# EAGLE schematic v1 (EAGLE 6.4)
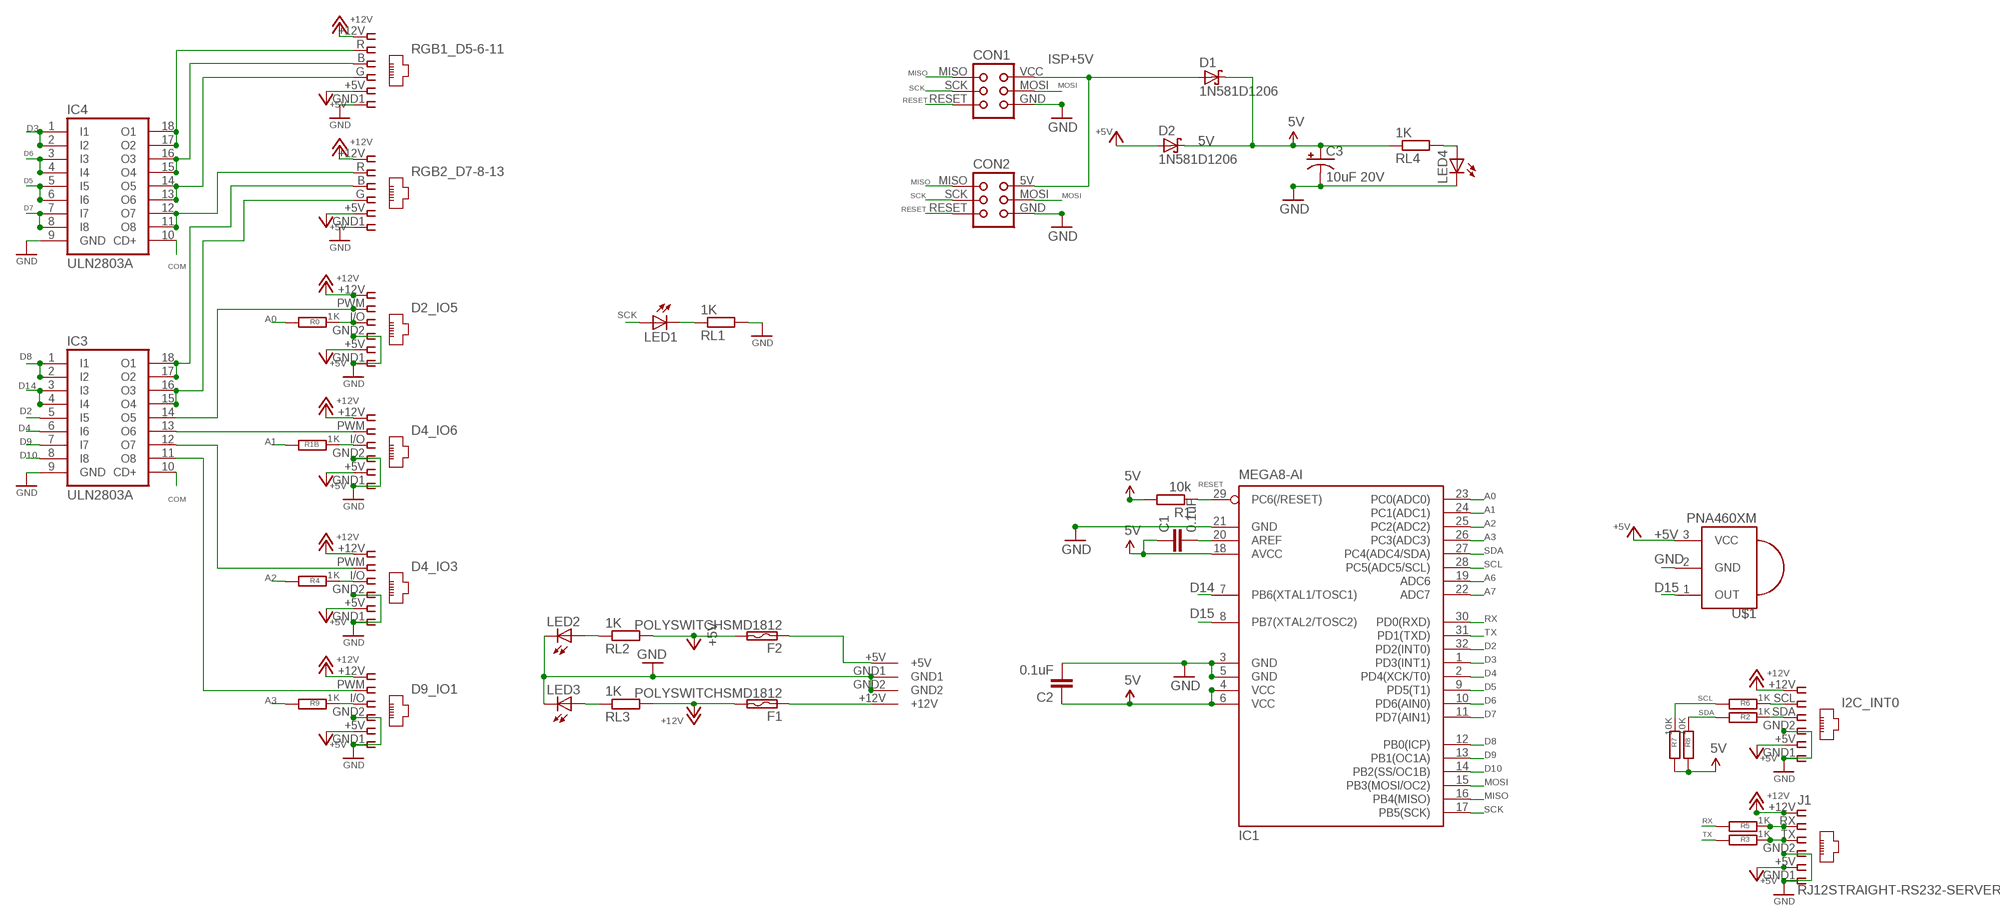
[diagram p0: schematic, sheet 1]

## Parts
C1  0.1uF  C-EUC1206  [C1206]
C2  0.1uF  C-EUC1206  [C1206]
C3  10uF 20V  CAP_POL1206-KIT  [EIA3216-KIT]
CON1  TINYISP  [TINYISP]
CON2  TINYISPTAG  [TC2030-MCP]
D1  1N581D1206  [LED-1206]
D2  1N581D1206  [LED-1206]
D2_IO5  IO5  RJ12STRAIGHT  [RJ12-STRAIGHT]
D4_IO3  IO3  RJ12STRAIGHT  [RJ12-STRAIGHT]
D4_IO6  IO6  RJ12STRAIGHT  [RJ12-STRAIGHT]
D9_IO1  IO1  RJ12STRAIGHT  [RJ12-STRAIGHT]
F1  POLYSWITCHSMD1812  [C1812]
F2  POLYSWITCHSMD1812  [C1812]
I2C_INT0  I2C  RJ12STRAIGHT-I2C  [RJ12-STRAIGHT-I2C]
IC1  MEGA8-AI  [TQFP32-08]
IC3  ULN2803A  [SO18W]
IC4  ULN2803A  [SO18W]
J1  RJ12STRAIGHT-RS232-SERVER  [RJ12-STRAIGHT-RS232]
LED1  LED3MM  [LED3MM]
LED2  LED3MM  [LED3MM]
LED3  LED3MM  [LED3MM]
LED4  LED3MM  [LED3MM]
R0  1K  R-EU_M1206  [M1206]
R1  10k  R-EU_M1206  [M1206]
R1B  1K  R-EU_M1206  [M1206]
R2  1K  R-EU_M1206  [M1206]
R3  1K  R-EU_M1206  [M1206]
R4  1K  R-EU_M1206  [M1206]
R5  1K  R-EU_M1206  [M1206]
R6  1K  R-EU_M1206  [M1206]
R7  10K  R-EU_M1206  [M1206]
R8  10K  R-EU_M1206  [M1206]
R9  1K  R-EU_M1206  [M1206]
RGB1_D5-6-11  RGB1  RJ12STRAIGHT-RGB  [RJ12-STRAIGHT-RGB]
RGB2_D7-8-13  RGB2  RJ12STRAIGHT-RGB  [RJ12-STRAIGHT-RGB]
RL1  1K  R-EU_M1206  [M1206]
RL2  1K  R-EU_M1206  [M1206]
RL3  1K  R-EU_M1206  [M1206]
RL4  1K  R-EU_M1206  [M1206]
U$1  PNA460XM  [PNA460XM]
U$2  KPJX-4S-S  [KPJX-4S-S]

## Nets
5V [power]: C1.1 C2.1 C3.A(+) D1.C D2.C IC1.4(VCC) IC1.6(VCC) IC1.18(AVCC) R1.2 R7.2 R8.2 RL4.1
+5V: D2.A D2_IO5.+5V D4_IO3.+5V D4_IO6.+5V D9_IO1.+5V F2.2 I2C_INT0.+5V J1.+5V RGB1_D5-6-11.+5V RGB2_D7-8-13.+5V RL2.2 U$1.3(VCC)
+12V [highpower]: D2_IO5.+12V D4_IO3.+12V D4_IO6.+12V D9_IO1.+12V F1.2 I2C_INT0.+12V J1.+12V RGB1_D5-6-11.+12V RGB2_D7-8-13.+12V RL3.2
A0: IC1.23(PC0(ADC0)) R0.2
A1 [fine]: IC1.24(PC1(ADC1)) R1B.2
A2 [fine]: IC1.25(PC2(ADC2)) R4.2
A3 [fine]: IC1.26(PC3(ADC3)) R9.2
A6: IC1.19(ADC6)
A7: IC1.22(ADC7)
COM: IC3.10(CD+) IC4.10(CD+)
D2: IC1.32(PD2(INT0)) IC3.5(I5)
D2B: D4_IO3.I/O R4.1
D2B1: D9_IO1.I/O R9.1
D2B4: I2C_INT0.SDA R2.1
D2B5: J1.TX R3.1
D2B6: D2_IO5.I/O R0.1
D2B7: D4_IO6.I/O R1B.1
D3: IC1.1(PD3(INT1)) IC4.1(I1) IC4.2(I2)
D4: IC1.2(PD4(XCK/T0)) IC3.6(I6)
D5: IC1.9(PD5(T1)) IC4.5(I5) IC4.6(I6)
D6: IC1.10(PD6(AIN0)) IC4.3(I3) IC4.4(I4)
D7: IC1.11(PD7(AIN1)) IC4.7(I7) IC4.8(I8)
D8: IC1.12(PB0(ICP)) IC3.1(I1) IC3.2(I2)
D9: IC1.13(PB1(OC1A)) IC3.7(I7)
D10: IC1.14(PB2(SS/OC1B)) IC3.8(I8)
D14: IC1.7(PB6(XTAL1/TOSC1)) IC3.3(I3) IC3.4(I4)
D15: IC1.8(PB7(XTAL2/TOSC2)) U$1.1(OUT)
GND [power]: C2.2 C3.C(-) CON1.GND CON2.GND D2_IO5.GND1 D2_IO5.GND2 D4_IO3.GND1 D4_IO3.GND2 D4_IO6.GND1 D4_IO6.GND2 D9_IO1.GND1 D9_IO1.GND2 I2C_INT0.GND1 I2C_INT0.GND2 IC1.3(GND) IC1.5(GND) IC1.21(GND) IC3.9(GND) IC4.9(GND) J1.GND1 J1.GND2 LED2.K(C) LED3.K(C) LED4.K(C) RGB1_D5-6-11.GND1 RGB2_D7-8-13.GND1 RL1.2 U$1.2(GND) U$2.GND1 U$2.GND2
ISP+5V: CON1.VCC CON2.5V(VCC) D1.A
MISO [fine]: CON1.MISO CON2.MISO IC1.16(PB4(MISO))
MOSI [fine]: CON1.MOSI CON2.MOSI IC1.15(PB3(MOSI/OC2))
N$1 [power]: IC4.13(O6) IC4.14(O5) RGB1_D5-6-11.G
N$2: D4_IO6.PWM IC3.13(O6)
N$3: LED1.K(C) RL1.1
N$4: C1.2 IC1.20(AREF)
N$5 [power]: IC4.11(O8) IC4.12(O7) RGB2_D7-8-13.R
N$6: F2.1 U$2.+5V
N$7: LED4.A RL4.2
N$8: F1.1 U$2.+12V
N$22 [power]: D4_IO3.PWM IC3.12(O7)
N$48 [power]: IC3.17(O2) IC3.18(O1) RGB2_D7-8-13.B
N$50 [power]: IC4.15(O4) IC4.16(O3) RGB1_D5-6-11.B
N$51 [power]: D9_IO1.PWM IC3.11(O8)
N$57 [power]: IC3.15(O4) IC3.16(O3) RGB2_D7-8-13.G
N$60 [power]: D2_IO5.PWM IC3.14(O5)
N$68 [power]: IC4.17(O2) IC4.18(O1) RGB1_D5-6-11.R
N$70: J1.RX R5.1
N$71: I2C_INT0.SCL R6.1
N$75: LED3.A RL3.1
N$76: LED2.A RL2.1
RESET [fine]: CON1.RESET CON2.RESET IC1.29(PC6(/RESET)) R1.1
RX: IC1.30(PD0(RXD)) R5.2
SCK [fine]: CON1.SCK CON2.SCK IC1.17(PB5(SCK)) LED1.A
SCL: IC1.28(PC5(ADC5/SCL)) R6.2 R7.1
SDA: IC1.27(PC4(ADC4/SDA)) R2.2 R8.1
TX: IC1.31(PD1(TXD)) R3.2

## Library data of the parts
C1 C2 = resistor:C-EU: CAPACITOR, European symbol
C3 = SparkFun:CAP_POL: Capacitor Polarized These are standard SMD and PTH capacitors. Normally 10uF, 47uF, and 100uF in electrolytic and tantalum varieties. Always verify the external diameter of the through hole cap, it varies with capacity, voltage, and manufacturer. The EIA devices should be standard.
CON1 = lpatiny:TINYISP: CONNECTOR; OC_FARNELL: unknown; OC_NEWARK: unknown
CON2 = lpatiny:TINYISP: CONNECTOR
D1 D2 = lpatiny:1N581*: 1.0A SCHOTTKY BARRIER RECTIFIER Source: http://www.diodes.com/datasheets/ds23001.pdf
D2_IO5 D4_IO3 D4_IO6 D9_IO1 I2C_INT0 J1 RGB1_D5-6-11 RGB2_D7-8-13 = lpatiny:RJ12: CORCOM Modular RJ Jacks No Shield Source: www.tycoelectronics.com .. ENG_DS_1654001_1099_RJ_L_0507.pdf
F1 F2 = lpatiny:POLYSWITCH: PolySwitch (TM) Resettable Device Source: Data sheet <http://www.farnell.com/datasheets/13482.pdf>
IC1 = atmel:MEGA8: MICROCONTROLLER 8 Kbytes FLASH, 1 kbytes SRAM, 512 bytes EEPROM, USART, 6-channel 10 bit ADC, 2-channel 8 bit ADC Pin compatible with Atmega48, ATMega88, ATMega168 Source: avr.lbr; MPN: ATMEGA8-16AU; OC_FARNELL: 9171371; OC_NEWARK: 73M8863
IC3 IC4 = lpatiny:ULN2803A: DRIVER ARRAY
LED1-LED4 = lpatiny:LED3MM
R0 R1 R1B R2-R9 RL1-RL4 = resistor:R-EU_: RESISTOR, European symbol
U$1 = adafruit:PNA460XM: IR 38KHz receiver PNA4602 and related receivers http://www.ladyada.net/library/pcb/eaglelibrary.html
U$2 = lpatiny:KPJX-4S-S

## Net classes
0 default: width 0.457 mm
1 power: width 0.457 mm
2 highpower: width 0.914 mm
3 fine: width 0.203 mm